# EAGLE schematic cs4272_test (EAGLE 6.5.0)
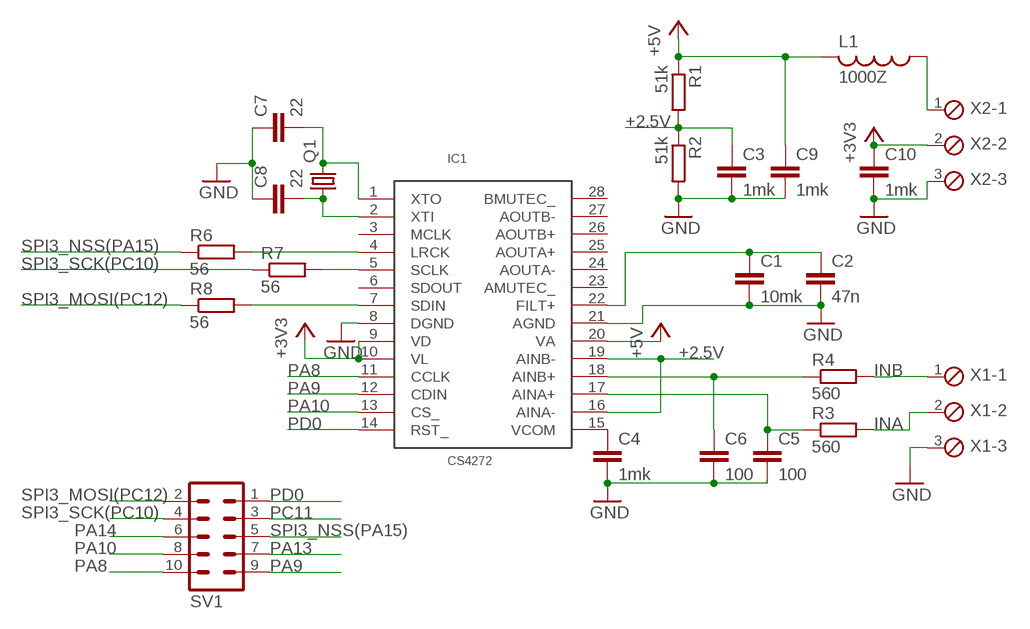
[diagram p0: schematic, sheet 1]

## Parts
C1  10mk  C-EUC0805  [C0805]
C2  47n  C-EUC0805  [C0805]
C3  1mk  C-EUC0603  [C0603]
C4  1mk  C-EUC0603  [C0603]
C5  100  C-EUC0805  [C0805]
C6  100  C-EUC0805  [C0805]
C7  22  C-EUC0603  [C0603]
C8  22  C-EUC0603  [C0603]
C9  1mk  C-EUC0603  [C0603]
C10  1mk  C-EUC0603  [C0603]
IC1  CS4272  [TSSOP28]
L1  1000Z  L-USL0805  [C0805]
Q1  CRYSTALHC49S  [HC49/S]
R1  51k  R-EU_R0603  [R0603]
R2  51k  R-EU_R0603  [R0603]
R3  560  R-EU_R0603  [R0603]
R4  560  R-EU_R0603  [R0603]
R6  56  R-EU_R0603  [R0603]
R7  56  R-EU_R0603  [R0603]
R8  56  R-EU_R0603  [R0603]
SV1  ML10  [ML10]
X1  MPT3  [3POL254]
X2  MPT3  [3POL254]

## Nets
+2.5V: C3.1 IC1.16(AINA-) IC1.19(AINB-) R1.2 R2.1
+3V3: C10.1 IC1.9(VD) IC1.10(VL) X2.2
+5V: C9.1 IC1.20(VA) L1.2 R1.1
GND: C1.2 C2.2 C3.2 C4.2 C5.2 C6.2 C7.1 C8.1 C9.2 C10.2 IC1.8(DGND) IC1.21(AGND) R2.2 X1.3 X2.3
INA: R3.2 X1.2
INB: R4.2 X1.1
N$1: C1.1 C2.1 IC1.22(FILT+)
N$2: C4.1 IC1.15(VCOM)
N$3: C6.1 IC1.18(AINB+) R4.1
N$4: C5.1 IC1.17(AINA+) R3.1
N$5: C8.2 IC1.2(XTI) Q1.1
N$6: C7.2 IC1.1(XTO) Q1.2
N$7: L1.1 X2.1
N$10: IC1.4(LRCK) R6.2
N$11: IC1.5(SCLK) R7.2
N$12: IC1.7(SDIN) R8.2
PA8: IC1.11(CCLK) SV1.10
PA9: IC1.12(CDIN) SV1.9
PA10: IC1.13(CS_) SV1.8
PA13: SV1.7
PA14: SV1.6
PC11: SV1.3
PD0: IC1.14(RST_) SV1.1
SPI3_MOSI(PC12): R8.1 SV1.2
SPI3_NSS(PA15): R6.1 SV1.5
SPI3_SCK(PC10): R7.1 SV1.4
Unconnected: IC1.3(MCLK) IC1.6(SDOUT) IC1.23(AMUTEC_) IC1.24(AOUTA-) IC1.25(AOUTA+) IC1.26(AOUTB+) IC1.27(AOUTB-) IC1.28(BMUTEC_)

## Library data of the parts
C1-C10 = rcl:C-EU: CAPACITOR, European symbol
IC1 = balmer:CS4272: 24-Bit, 192 kHz Stereo Audio CODEC
L1 = rcl:L-US: INDUCTOR, American symbol
Q1 = crystal:CRYSTAL: CRYSTAL; OC_FARNELL: 1667008; OC_NEWARK: unknown
R1-R4 R6-R8 = rcl:R-EU_: RESISTOR, European symbol
SV1 = con-ml:ML10: HARTING; OC_FARNELL: unknown; OC_NEWARK: unknown
X1 X2 = con-phoenix-254:MPT3: PHOENIX CONNECTOR; OC_FARNELL: unknown; OC_NEWARK: unknown